# Altium schematic sheet Power.SchDoc
size A; SheetNumber: 4; SheetTotal: 4
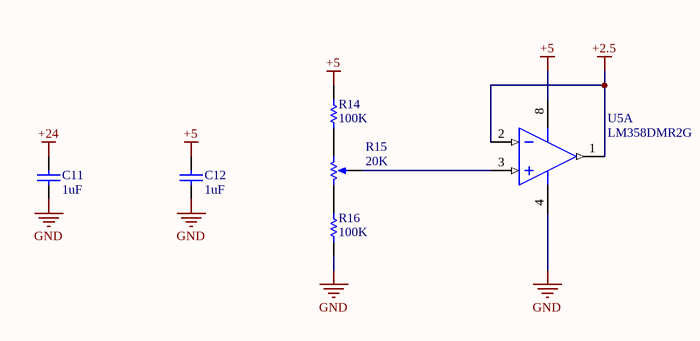
[diagram p0: Power.SchDoc]

## Parts
C11  1uF  [CAPC1608X10M]
C12  1uF  [CAPC1608X10M]
R14  100K  [RESC1608X06M]
R15  20K  [TC33X-1_BRN]
R16  100K  [RESC1608X06M]
U5  LM358DMR2G  [ONSC-MICRO-8-846A-02_H_V]  (part A of 2)

## Nets
+2.5: U5.1(OUTA) U5.2(INA-)
+5: C12.2 R14.2 U5.8(VCC)
+24: C11.2
GND: C11.1 C12.1 R16.1 U5.4(VEE/GND)
NetR14_1: R14.1 R15.1(TOP)
NetR15_2: R15.2(BOT) R16.2
NetR15_3: R15.3(TAP) U5.3(INA+)

## Library data of the parts
C11 C12 = GRM188: GRM188 0603(1.6mm*0.8mm) ±5% and ±10% (15pF-2.2uF) SMD Capacitor; Published: 8-Jun-2000; LatestRevisionDate: 17-Jul-2002; LatestRevisionNote: Re-released for DXP Platform.; PackageReference: RAD-0.3; Publisher: Altium Limited; PackageDescription: Radial Cap, Thru-Hole; 2 Leads; 0.3 in Pin Spacing
R14 R16 = RC0603_JR07: RC0603 JR-07 0603 (1.6mm*0.8mm) ±1% 1% (0R-4.7MR) chip resistor; Published: 8-Jun-2000; LatestRevisionDate: 17-Jul-2002; LatestRevisionNote: Re-released for DXP Platform.; PackageReference: AXIAL-0.3; Publisher: Altium Limited; PackageDescription: Axial Device, Thru-Hole; 2 Leads; 0.3 in Pin Spacing
R15 = TC33X-1-203E: TRIMMER 20K OHM 0.1W J LEAD TOP; pin to pad: 2>3 3>2; Sim Note: Enter the Resistance value and the set point into parameter fields.; Set Position: 0.5; Published: 8-Jun-2000; LatestRevisionDate: 17-Jul-2002; LatestRevisionNote: Re-released for DXP Platform.; PackageReference: VR5; Publisher: Altium Limited; PackageDescription: Variable Resistor, Thru-Hole; 3 Leads; Value: 20K
U5 = CMP-1310-00018-1: Single Supply Dual Operational Amplifier, 3 to 32 V, 0 to 70 degC, 8-Pin MICRO, Pb-Free, Tape and Reel; Manufacturer: On Semiconductor; VCC Min (V): 3; VCC Max (V): 32; PackageDescription: 8-Pin Small Outline Package, Body 3 x 3 mm, Pitch 0.65 mm; ComponentLink2URL: http://www.onsemi.cn/pub_link/Collateral/LM358-D.PDF; ComponentLink2Description: Datasheet; ComponentLink1Description: Manufacturer URL; PackageVersion: Rev. H; Packing: Tape and Reel; RoHS: TRUE; DatasheetVersion: Rev. 27; PartNumber: LM358DMR2G; ComponentLink3Description: Package Specification; ComponentLink1URL: http://www.onsemi.com/; Mounting Technology: Surface Mount; ComponentLink3URL: http://www.onsemi.com/pub_link/Collateral/NLSV2T244-D.PDF; PackageReference: MICRO-8-846A-02_H